# Altium schematic sheet SAML21_Xplained_Pro_triple_input_power_supply.SchDoc: Power supply
size A3; Organization: ATMEL Norway; Address1: Vestre Rosten 79; Address2: N-7075 TILLER; Address3: NORWAY; DocumentNumber: A09-2241; Revision: 4; SheetNumber: 5; SheetTotal: 10; PageSetup: Record=PageOptions|CenterHorizontal=True|CenterVertical=True|PrintScale=1.01|XCorrection=1.00|YCorrection=1.00|PrintKind=1|BorderSize=5000000|LeftOffset=0|BottomOffset=0|Orientation=2|PaperLength=1000|PaperWidth=1000|Scale=100|PaperSource=7|PrintQuality=-4|MediaType=1|DitherType=10|PaperKind=A3 (297 x 420 mm)|PrintScaleMode=1
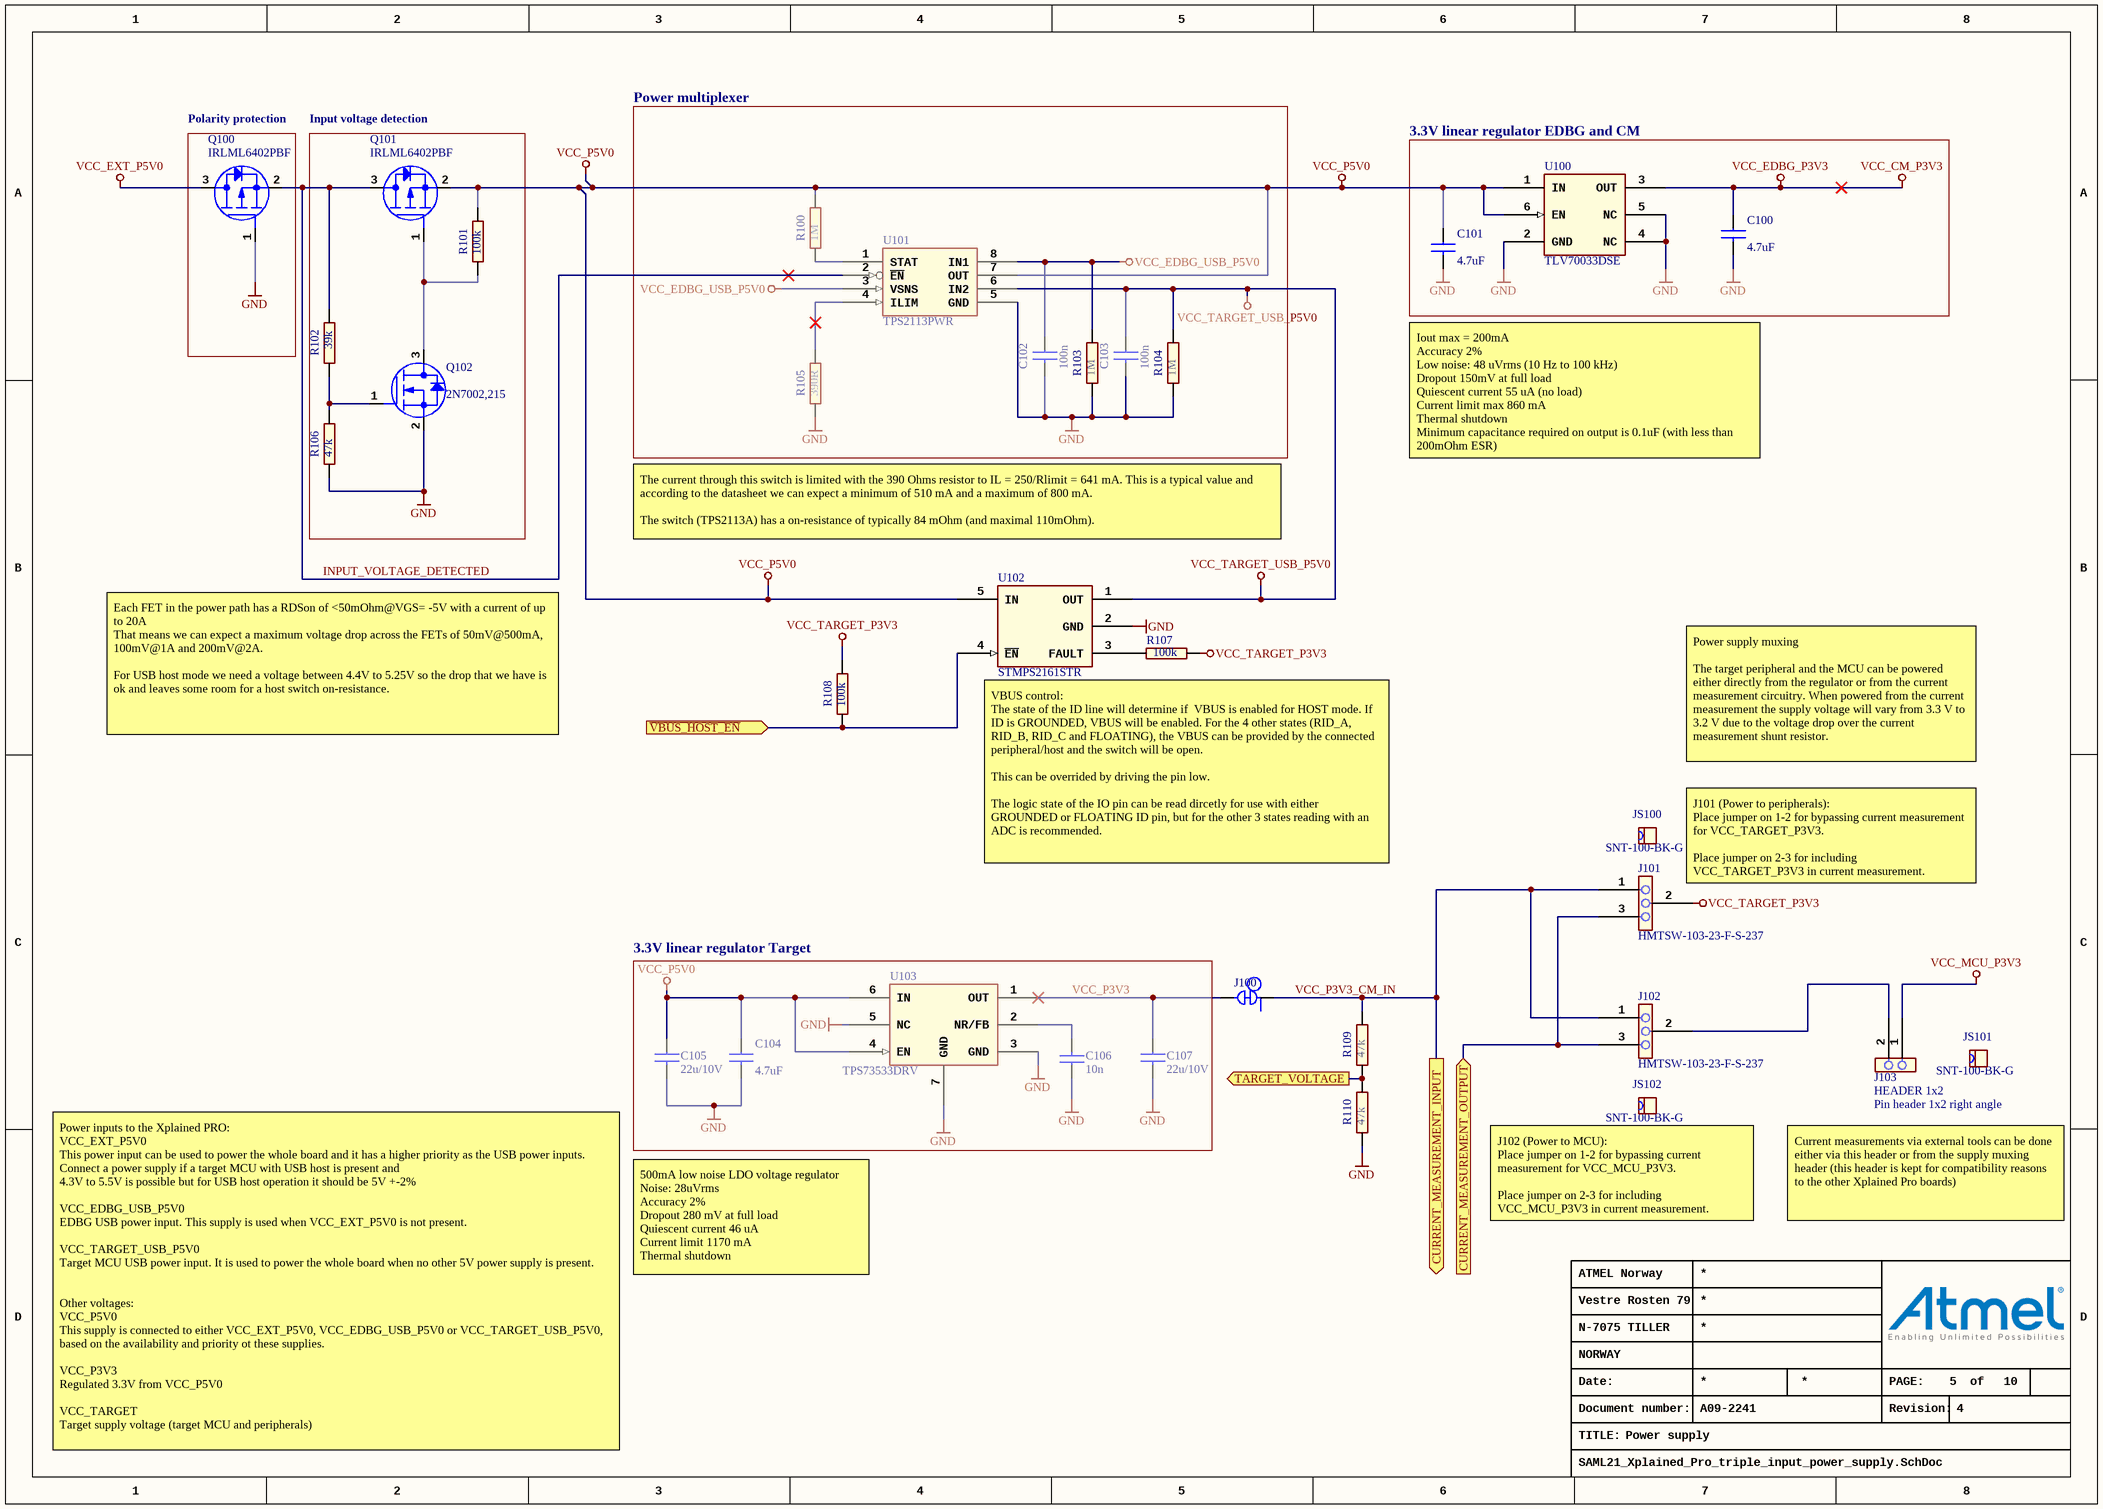
[diagram p0: SAML21_Xplained_Pro_triple_input_power_supply.SchDoc]

## Parts
C100  value 4.7uF  [AP1-00117]  (hidden comment: CAP-NONPOL)
C101  value 4.7uF  [AP1-00117]  (hidden comment: CAP-NONPOL)
C102  value 100n  [AP1-00053]  (hidden comment: CAP-NONPOL)
C103  value 100n  [AP1-00053]  (hidden comment: CAP-NONPOL)
C104  value 4.7uF  [AP1-00117]  (hidden comment: CAP-NONPOL)
C105  value 22u/10V  [AP1-00003]  (hidden comment: CAP-NONPOL)
C106  value 10n  [AP1-00053]  (hidden comment: CAP-NONPOL)
C107  value 22u/10V  [AP1-00003]  (hidden comment: CAP-NONPOL)
J100  SMD-STRAP_CLOSED  [AP9-00044]  (value not drawn)  (net tie, no BOM)
J101  value HMTSW-103-23-F-S-237  [AP8-00745]  (hidden comment: Same as A08-1614 but with 1mm hole for optimal reflow soldering (no misalignment of the component))
J102  value HMTSW-103-23-F-S-237  [AP8-00745]  (hidden comment: Same as A08-1614 but with 1mm hole for optimal reflow soldering (no misalignment of the component))
J103  HEADER 1x2  value Pin header 1x2 right angle  [AP8-00367]
JS100  value SNT-100-BK-G  [AP8-00525]
JS101  value SNT-100-BK-G  [AP8-00525]
JS102  value SNT-100-BK-G  [AP8-00525]
Q100  value IRLML6402PBF  [AP5-00002]  (hidden comment: MOSFET_P_GSD)
Q101  value IRLML6402PBF  [AP5-00002]  (hidden comment: MOSFET_P_GSD)
Q102  value 2N7002,215  [AP5-00002]  (hidden comment: MOSFET_N_GSD)
R100  value 1M  [AP2-00011]  (hidden comment: R2)
R101  value 100k  [AP2-00011]  (hidden comment: R2)
R102  value 39k  [AP2-00011]  (hidden comment: R2)
R103  value 1M  [AP2-00011]  (hidden comment: R2)
R104  value 1M  [AP2-00011]  (hidden comment: R2)
R105  value 390R  [AP2-00011]  (hidden comment: R2)
R106  value 47k  [AP2-00011]  (hidden comment: R2)
R107  value 100k  [AP2-00011]  (hidden comment: R2)
R108  value 100k  [AP2-00011]  (hidden comment: R2)
R109  value 47k  [AP2-00011]  (hidden comment: R2)
R110  value 47k  [AP2-00011]  (hidden comment: R2)
U100  value TLV70033DSE  [AP6-00262]  (hidden comment: TLV70033)
U101  value TPS2113PWR  [AP6-00054]  (hidden comment: TPS2112)
U102  value STMPS2161STR  [AP6-00087]  (hidden comment: STMPS2161)
U103  value TPS73533DRV  [AP6-00162]  (hidden comment: TPS735xxDRV)

## Blocks framed on the sheet
Power multiplexer: C102 C103 R100 R103-R105 U101
Polarity protection: Q100
Input voltage detection: Q101 Q102 R101 R102 R106
3.3V linear regulator EDBG and CM: C100 C101 U100
3.3V linear regulator Target: C104-C107 U103

## Ports
CURRENT_MEASUREMENT_INPUT (out), CURRENT_MEASUREMENT_OUTPUT (in), TARGET_VOLTAGE (out), ~{VBUS_HOST_EN} (in)

## Nets
GND: C100.2 C101.2 C102.2 C103.2 C104.2 C105.2 C106.1 C107.2 Q100.1(G) Q102.2(S) R103.1 R104.1 R105.1 R106.1 R110.1 U100.2(GND) U100.4(NC) U100.5(NC) U101.5(GND) U102.2(GND) U103.3(GND) U103.5(NC) U103.7(GND)
VCC_CM_P3V3: C100.1 U100.3(OUT)  [also labelled VCC_EDBG_P3V3]
VCC_EDBG_USB_P5V0: C102.1 R103.2 U101.3(VSNS) U101.8(IN1)
VCC_EXT_P5V0: Q100.3(D)
VCC_MCU_P3V3: J103.1
VCC_P5V0: C101.1 C104.1 C105.1 Q101.2(S) R100.2 R101.2 U100.1(IN) U100.6(EN) U101.7(OUT) U102.5(IN) U103.4(EN) U103.6(IN)
VCC_TARGET_P3V3: J101.2 R107.1 R108.2
VCC_TARGET_USB_P5V0: C103.1 R104.2 U101.6(IN2) U102.1(OUT)
CURRENT_MEASUREMENT_OUTPUT: J101.3 J102.3 ; port CURRENT_MEASUREMENT_OUTPUT
INPUT_VOLTAGE_DETECTED: Q100.2(S) Q101.3(D) R102.2 U101.2(~{EN})
TARGET_VOLTAGE: R109.1 R110.2 ; port TARGET_VOLTAGE
~{VBUS_HOST_EN}: R108.1 U102.4(~{EN}) ; port ~{VBUS_HOST_EN}
VCC_P3V3: C107.1 J100.2 U103.1(OUT)
VCC_P3V3_CM_IN: J100.1 J101.1 J102.1 R109.2 ; port CURRENT_MEASUREMENT_INPUT
NetC106_2: C106.2 U103.2(NR/FB)
NetJ102_2: J102.2 J103.2
NetQ101_1: Q101.1(G) Q102.3(D) R101.1
NetQ102_1: Q102.1(G) R102.1 R106.2
NetR100_1: R100.1 U101.1(STAT)
NetR105_2: R105.2 U101.4(ILIM)
NetR107_2: R107.2 U102.3(FAULT)

## Notes on the sheet
- Iout max = 200mA
  Accuracy 2%
  Low noise: 48 uVrms (10 Hz to 100 kHz)
  Dropout 150mV at full load
  Quiescent current 55 uA (no load)
  Current limit max 860 mA
  Thermal shutdown
  Minimum capacitance required on output is 0.1uF (with less than 200mOhm ESR)
- The current through this switch is limited with the 390 Ohms resistor to IL = 250/Rlimit = 641 mA. This is a typical value and according to the datasheet we can expect a minimum of 510 mA and a maximum of 800 mA.
  The switch (TPS2113A) has a on-resistance of typically 84 mOhm (and maximal 110mOhm).
- Each FET in the power path has a RDSon of <50mOhm@VGS= -5V with a current of up to 20A
  That means we can expect a maximum voltage drop across the FETs of 50mV@500mA, 100mV@1A and 200mV@2A.
  For USB host mode we need a voltage between 4.4V to 5.25V so the drop that we have is ok and leaves some room for a host switch on-resistance.
- Power supply muxing
  The target peripheral and the MCU can be powered either directly from the regulator or from the current measurement circuitry. When powered from the current measurement the supply voltage will vary from 3.3 V to 3.2 V due to the voltage drop over the current measurement shunt resistor.
- VBUS control:
  The state of the ID line will determine if  VBUS is enabled for HOST mode. If ID is GROUNDED, VBUS will be enabled. For the 4 other states (RID_A,  RID_B, RID_C and FLOATING), the VBUS can be provided by the connected peripheral/host and the switch will be open.
  This can be overrided by driving the pin low.
  The logic state of the IO pin can be read dircetly for use with either GROUNDED or FLOATING ID pin, but for the other 3 states reading with an ADC is recommended.
- J101 (Power to peripherals):
  Place jumper on 1-2 for bypassing current measurement for VCC_TARGET_P3V3.
  Place jumper on 2-3 for including VCC_TARGET_P3V3 in current measurement.
- (near JS102) J102 (Power to MCU):
  Place jumper on 1-2 for bypassing current measurement for VCC_MCU_P3V3.
  Place jumper on 2-3 for including VCC_MCU_P3V3 in current measurement.
- Current measurements via external tools can be done either via this header or from the supply muxing header (this header is kept for compatibility reasons to the other Xplained Pro boards)
- 500mA low noise LDO voltage regulator
  Noise: 28uVrms
  Accuracy 2%
  Dropout 280 mV at full load
  Quiescent current 46 uA
  Current limit 1170 mA
  Thermal shutdown
- Power inputs to the Xplained PRO:
  VCC_EXT_P5V0
  This power input can be used to power the whole board and it has a higher priority as the USB power inputs. Connect a power supply if a target MCU with USB host is present and
  4.3V to 5.5V is possible but for USB host operation it should be 5V +-2%
  VCC_EDBG_USB_P5V0
  EDBG USB power input. This supply is used when VCC_EXT_P5V0 is not present.
  VCC_TARGET_USB_P5V0
  Target MCU USB power input. It is used to power the whole board when no other 5V power supply is present.
  Other voltages:
  VCC_P5V0
  This supply is connected to either VCC_EXT_P5V0, VCC_EDBG_USB_P5V0 or VCC_TARGET_USB_P5V0, based on the availability and priority ot these supplies.
  VCC_P3V3
  Regulated 3.3V from VCC_P5V0
  VCC_TARGET
  Target supply voltage (target MCU and peripherals)
- Date:
- PAGE:
- of
- TITLE:
- Document number:
- Revision:

## Library data of the parts
C100 C101 C104 = A01-0377: Ceramic capacitor, SMD 0603, X5R, 10V, 10% (de31036); PartGroup: Capacitors,Ceramic,SMD 0603; Manufacturer: tdk; MPN: C1608X5R1A475K; TemperatureRange: -55 - +85 deg C; AN: A01-0377; Tolerance: 10%; Height: 0.800000011920929
C102 C103 = A01-0246: Ceramic capacitor, SMD 0402, X7R, 16V, +/-10%; PartGroup: Capacitors,Ceramic,SMD 0402; Manufacturer: Kemet; MPN: C0402C104K4RACTU; TemperatureRange: -55 - +125 deg C; AN: A01-0246; Tolerance: 16V, +/-10%; Height: 0.5
C105 C107 = A01-0500: Ceramic capacitor, SMD 0805, X5R, 10V, Â±20%; PartGroup: Capacitors,Ceramic,SMD 0805; Manufacturer: tdk; MPN: C2012X5R1A226M/0.85; TemperatureRange: -55Â°C to +85Â°C; AN: A01-0500; Height: 0.949999988079071
C106 = A01-0050: Ceramic capacitor, SMD 0402, X7R, 25V, +/-10%; PartGroup: Capacitors,Ceramic,SMD 0402; TemperatureRange: -55 - +125 deg C; AN: A01-0050; Tolerance: 25V, +/-10%; Height: 0.550000011920929
J100 = A09-0783: Default closed SMD strap, 0603 size; PartGroup: Mechanical devices,PCB implemented components; Value: SMD-STRAP_0603_CLOSED; AN: A09-0783; Height: 0
J101 J102 = A08-1799: 1x3 pin header, 2.54mm pitch, Pin-in-Paste THM, 1mm hole; PartGroup: Mechanical devices,Connectors,Pin headers; Manufacturer: SAMTEC; AN: A08-1799; Height: 6,09999990463257; MPN: HMTSW-103-23-F-S-237
J103 = A08-0764: 1x2 pin header, right angle, 2.54 mm pitch, through-hole; PartGroup: Mechanical devices,Connectors,Pin headers; Manufacturer: Pro-data International Corp; MPN: 2213R-2G; AN: A08-0764; Height: 2.53999996185303
JS100-JS102 = A08-0543: Jumper cap for 2.54mm pinheader; PartGroup: Mechanical devices,Mounting accessories,Other; Manufacturer: SAMTEC; AN: A08-0543; MPN: SNT-100-BK-G
Q100 Q101 = A05-0087: P-ch. MOSFET. -30V, -3.7A continuous,RDS(ON)=0.05Ohm@VGS=-4,5V, RDS(ON)=0.08Ohm@VGS=-2.5V; PartGroup: Transistors,Power FET,SMD; Manufacturer: International Rectifier; TemperatureRange: -55 - +150 deg C; AN: A05-0087; Height: 1.14999997615814; MPN: IRLML6402PBF
Q102 = A05-0085: N-Channel MOSFET. 60V, 0.300A continuous, 1.2A Peak. RDS(ON) = 3.8Ohm@VGS=4.5V, VGS(th)<2.5V; PartGroup: Transistors,Small signal FET,SMD; Manufacturer: NXP; TemperatureRange: -65 to 150 deg C; AN: A05-0085; Height: 1.10000002384186; MPN: 2N7002,215
R100 R103 R104 = A02-0284: Thick film resistor, SMD 0402, 1/16W, 1%; PartGroup: Resistors,SMD,0402 1%; TemperatureRange: -55 - +125 deg C; AN: A02-0284; Tolerance: 1 %; Height: 0.349999994039536
R101 R107 R108 = A02-0260: Thick film resistor, SMD 0402, 1/16W, 1%; PartGroup: Resistors,SMD,0402 1%; TemperatureRange: -55 - +125 deg C; AN: A02-0260; Tolerance: 1 %; Height: 0.349999994039536
R102 = A02-0250: Thick film resistor, SMD 0402, 1/16W, 1%; PartGroup: Resistors,SMD,0402 1%; TemperatureRange: -55 - +125 deg C; AN: A02-0250; Tolerance: 1 %; Height: 0.349999994039536
R105 = A02-0202: Thick film resistor, SMD 0402, 1/16W, 1%; PartGroup: Resistors,SMD,0402 1%; TemperatureRange: -55 - +125 deg C; AN: A02-0202; Tolerance: 1 %; Height: 0.349999994039536
R106 R109 R110 = A02-0252: Thick film resistor, SMD 0402, 1/16W, 1%; PartGroup: Resistors,SMD,0402 1%; TemperatureRange: -55 - +125 deg C; AN: A02-0252; Tolerance: 1 %; Height: 0.349999994039536
U100 = A06-0719: LDO, 200 mA, Iq=31 uA, Vdo=250mV, Vout=3.3V, VIN= 2 V to 5.5V, SON-6 package; PartGroup: Integrated Circuits,Regulators,Linear; Manufacturer: Texas Instruments; AN: A06-0719; Height: 0.800000011920929; MPN: TLV70033DSE
U101 = A06-0068: Autoswitching 2:1 Power Mux; PartGroup: Integrated Circuits,General linear,Analog switch, bus switch and MUX; Manufacturer: Texas Instruments; TemperatureRange: -40 - + 125 deg C; AN: A06-0068; Height: 1.20000004768372; MPN: TPS2113PWR
U102 = A06-1087: Single channel power switch, 1A, reverse block, active low enabled.; PartGroup: Integrated Circuits,General linear,Analog switch, bus switch and MUX; Tolerance: 2.7 to 5.5V; TemperatureRange: -40Â°C to +85Â°C; Design comment: *; AN: A06-1087; Height: 1,45000004768372
U103 = A06-1135: Low noise LDO, 500 mA, Vout=3.3V, 2% accuracy, IQ=46uA, noise=28uVrms, VIN= 2.7V to 6.5V, Vdo=280mV,stable with low ESR capacitor; PartGroup: Integrated Circuits,Regulators,Linear; Manufacturer: Texas Instruments; AN: A06-1135; Height: 0.75; MPN: TPS73533DRV